# EAGLE design Doorbell (EAGLE 6.3)
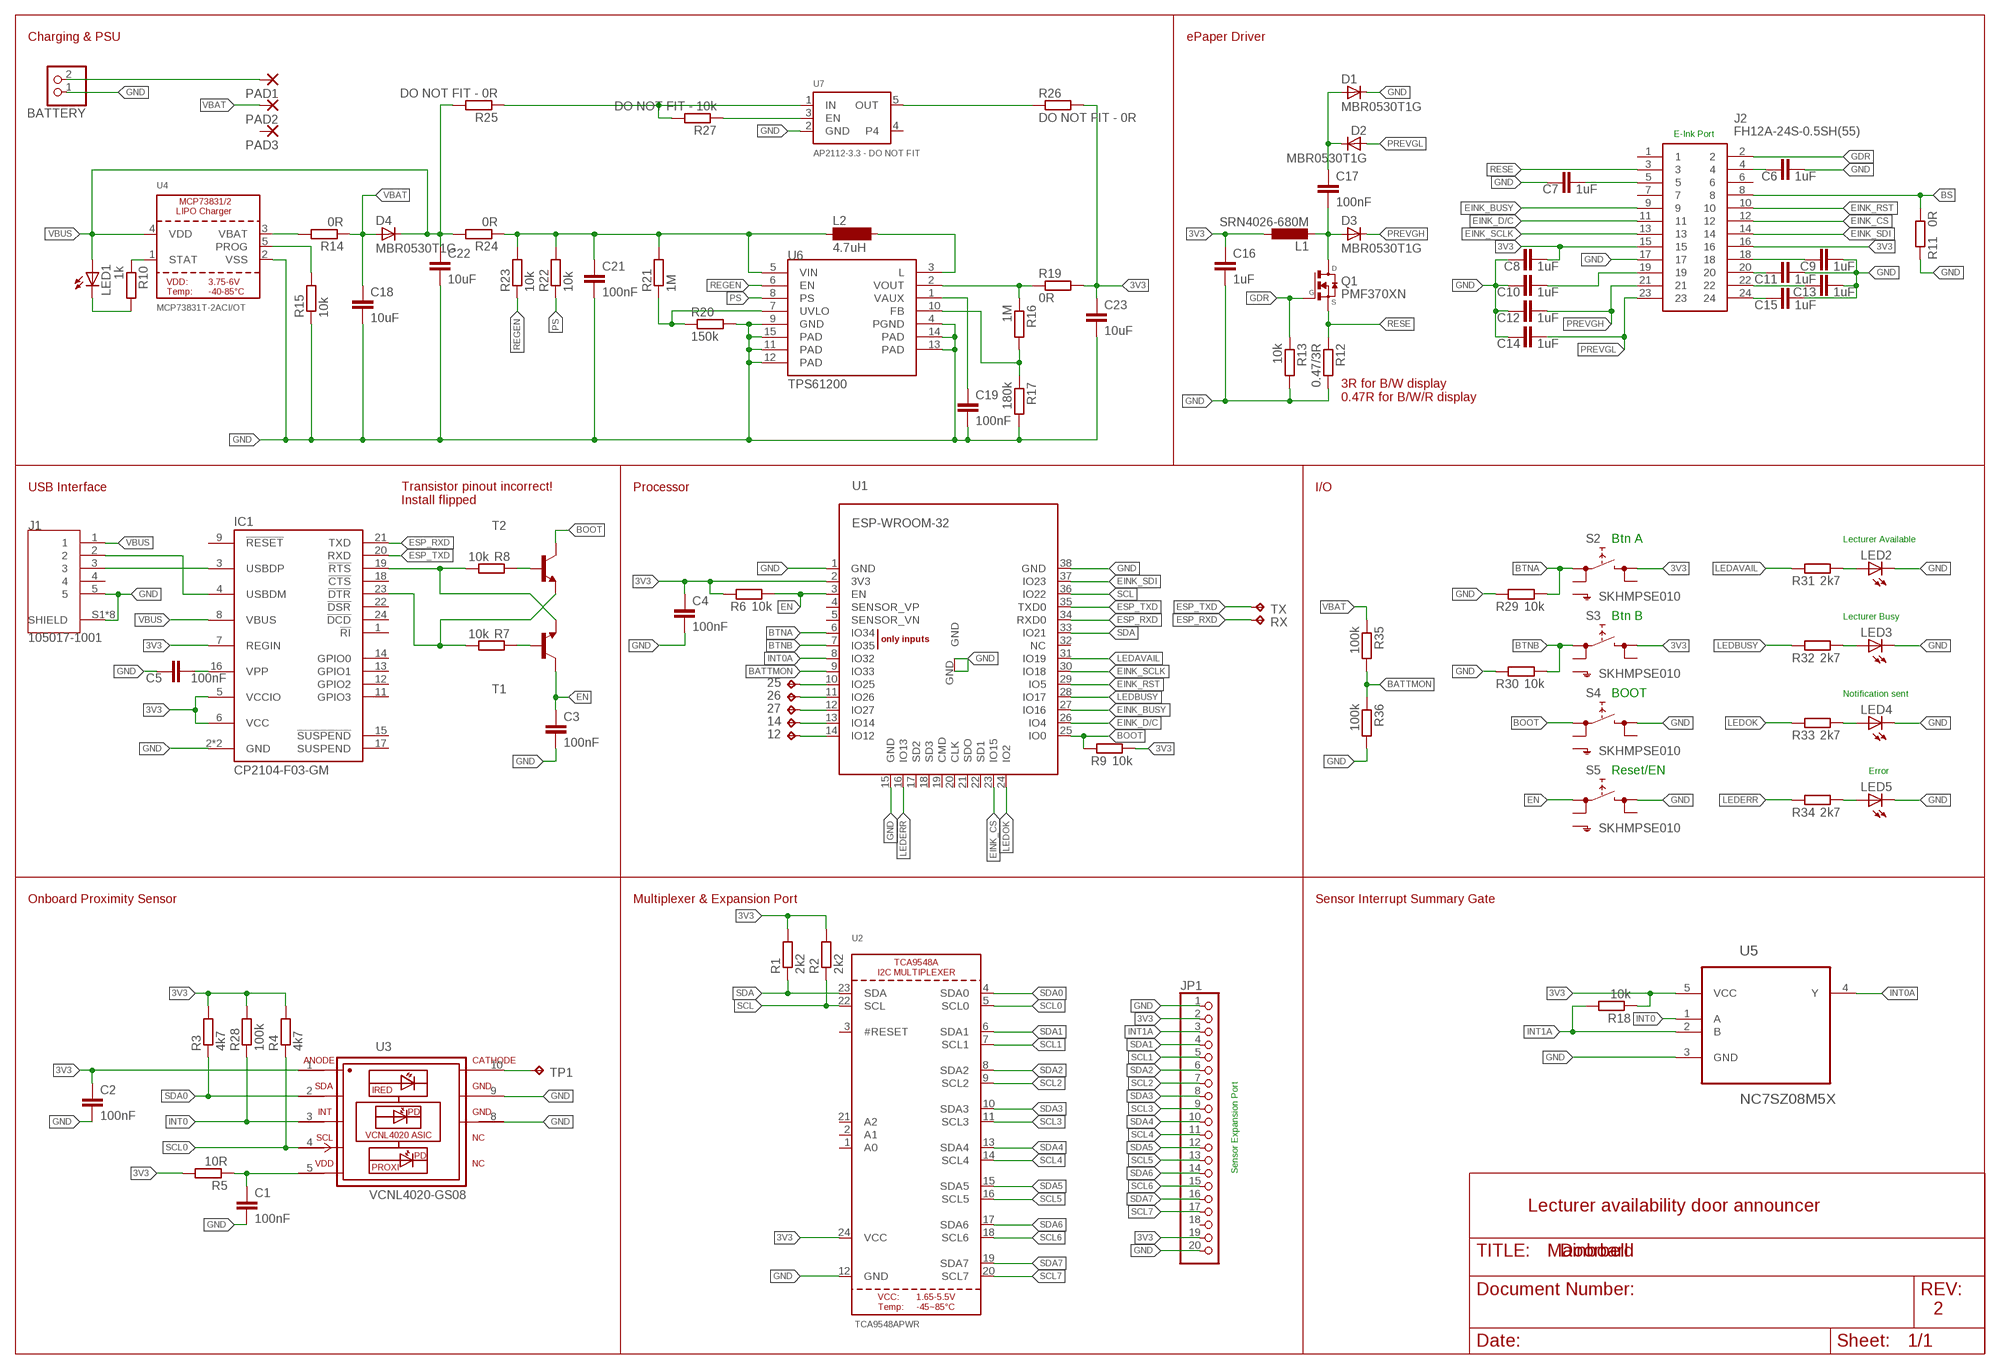
[diagram p0: schematic, sheet 1]

## Parts
12  TPB1,27  [B1,27]
14  TPB1,27  [B1,27]
25  TPB1,27  [B1,27]
26  TPB1,27  [B1,27]
27  TPB1,27  [B1,27]
BATTERY  PINHD-1X2/90  [1X02/90]
C1  100nF  C-EUC0603  [C0603]
C2  100nF  C-EUC0603  [C0603]
C3  100nF  C-EUC0603  [C0603]
C4  100nF  C-EUC0603  [C0603]
C5  100nF  C-EUC0603  [C0603]
C6  1uF  C-EUC0603  [C0603]
C7  1uF  C-EUC0603  [C0603]
C8  1uF  C-EUC0603  [C0603]
C9  1uF  C-EUC0603  [C0603]
C10  1uF  C-EUC0603  [C0603]
C11  1uF  C-EUC0603  [C0603]
C12  1uF  C-EUC0603  [C0603]
C13  1uF  C-EUC0603  [C0603]
C14  1uF  C-EUC0603  [C0603]
C15  1uF  C-EUC0603  [C0603]
C16  1uF  C-EUC0603  [C0603]
C17  100nF  C-EUC0603  [C0603]
C18  10uF  C-EUC1206  [C1206]
C19  100nF  C-EUC0603  [C0603]
C21  100nF  C-EUC0603  [C0603]
C22  10uF  C-EUC1206  [C1206]
C23  10uF  C-EUC1206  [C1206]
D1  MBR0530T1G  D-SOD123  [SOD123]
D2  MBR0530T1G  D-SOD123  [SOD123]
D3  MBR0530T1G  D-SOD123  [SOD123]
D4  MBR0530T1G  D-SOD123  [SOD123]
IC1  CP2104-F03-GM  [QFN24-PAD]
J1  105017-1001  [MOLEX_105017-1001]
J2  FH12A-24S-0.5SH(55)  [FH12A-24S-0.5SH]
JP1  PINHD-1X20/90  [1X20/90]
L1  SRN4026-680M  L-EUL4532P  [L4532P]
L2  4.7uH  MS50  [MS50]
LED1  LEDSML0603  [SML0603]
LED2  LEDSML0603  [SML0603]
LED3  LEDSML0603  [SML0603]
LED4  LEDSML0603  [SML0603]
LED5  LEDSML0603  [SML0603]
PAD1  WIREPADSMD1,27-254  [SMD1,27-2,54]
PAD2  WIREPADSMD1,27-254  [SMD1,27-2,54]
PAD3  WIREPADSMD1,27-254  [SMD1,27-2,54]
Q1  PMF370XN  BSS138W  [SOT323-R]
R1  2k2  R-EU_R0603  [R0603]
R2  2k2  R-EU_R0603  [R0603]
R3  4k7  R-EU_R0603  [R0603]
R4  4k7  R-EU_R0603  [R0603]
R5  10R  R-EU_R0603  [R0603]
R6  10k  R-EU_R0603  [R0603]
R7  10k  R-EU_R0603  [R0603]
R8  10k  R-EU_R0603  [R0603]
R9  10k  R-EU_R0603  [R0603]
R10  1k  R-EU_R0603  [R0603]
R11  0R  R-EU_R0603  [R0603]
R12  0.47/3R  R-EU_R0603  [R0603]
R13  10k  R-EU_R0603  [R0603]
R14  0R  R-EU_R0603  [R0603]
R15  10k  R-EU_R0603  [R0603]
R16  1M  R-EU_R0603  [R0603]
R17  180k  R-EU_R0603  [R0603]
R18  10k  R-EU_R0603  [R0603]
R19  0R  R-EU_R0603  [R0603]
R20  150k  R-EU_R0603  [R0603]
R21  1M  R-EU_R0603  [R0603]
R22  10k  R-EU_R0603  [R0603]
R23  10k  R-EU_R0603  [R0603]
R24  0R  R-EU_R0603  [R0603]
R25  DO NOT FIT - 0R  R-EU_R0603  [R0603]
R26  DO NOT FIT - 0R  R-EU_R0603  [R0603]
R27  DO NOT FIT - 10k  R-EU_R0603  [R0603]
R28  100k  R-EU_R0603  [R0603]
R29  10k  R-EU_R0603  [R0603]
R30  10k  R-EU_R0603  [R0603]
R31  2k7  R-EU_R0603  [R0603]
R32  2k7  R-EU_R0603  [R0603]
R33  2k7  R-EU_R0603  [R0603]
R34  2k7  R-EU_R0603  [R0603]
R35  100k  R-EU_R0603  [R0603]
R36  100k  R-EU_R0603  [R0603]
RX  TPB1,27  [B1,27]
S2  SKHMPSE010  [SKHMPXE010]
S3  SKHMPSE010  [SKHMPXE010]
S4  SKHMPSE010  [SKHMPXE010]
S5  SKHMPSE010  [SKHMPXE010]
T1  -NPN-SOT23-EBC  [SOT23-EBC]
T2  -NPN-SOT23-EBC  [SOT23-EBC]
TP1  TPB1,27  [B1,27]
TX  TPB1,27  [B1,27]
U1  ESP-WROOM-32  [ESP-WROOM-32]
U2  TCA9548APWR  TCA9548A  [TSSOP24]
U3  VCNL4020-GS08  [PHODET_VCNL4020]
U4  MCP73831T-2ACI/OT  MCP73831/2  [SOT23-5]
U5  NC7SZ08M5X  [SOT95P280X145-5N]
U6  TPS61200  [QFN-10_PAD]
U7  AP2112-3.3 - DO NOT FIT  VREG_SOT23-5  [SOT23-5]

## Nets
3V3: C2.1 C4.1 C8.2 C16.1 C23.1 IC1.5(VCCIO) IC1.6(VCC) IC1.7(REGIN) J2.15 J2.16 JP1.2 JP1.19 L1.1 R1.2 R2.2 R3.2 R4.2 R5.2 R6.2 R9.1 R18.1 R19.2 R26.2 R28.2 S2.3(2.1) S3.3(2.1) U1.2(3V3) U2.24(VCC) U3.1(IR-ANODE) U5.5(VCC)
BATTMON: R35.2 R36.1 U1.9(IO33)
BOOT: R9.2 S4.1(1.1) T2.C U1.25(IO0)
BS: J2.8 R11.1
BTNA: R29.1 S2.1(1.1) U1.6(IO34)
BTNB: R30.1 S3.1(1.1) U1.7(IO35)
DTR: IC1.23(!DTR) R7.1 T2.E
EINK_BUSY: J2.9 U1.27(IO16)
EINK_CS: J2.12 U1.23(IO15)
EINK_D/C: J2.11 U1.26(IO4)
EINK_RST: J2.10 U1.29(IO5)
EINK_SCLK: J2.13 U1.30(IO18)
EINK_SDI: J2.14 U1.37(IO23)
EN: C3.1 R6.1 S5.1(1.1) T1.C U1.3(EN)
ESP_RXD: IC1.21(TXD) RX.TP U1.34(RXD0)
ESP_TXD: IC1.20(RXD) TX.TP U1.35(TXD0)
GDR: J2.2 Q1.1(G) R13.1
GND: BATTERY.1 C1.2 C2.2 C3.2 C4.2 C5.1 C6.2 C7.1 C8.1 C9.2 C10.1 C11.2 C12.1 C13.2 C14.1 C15.2 C16.2 C18.2 C19.2 C21.2 C22.2 C23.2 D1.1(C) IC1.2(GND) IC1.TP(GND) J1.5 J1.S1(SHIELD) J1.S1.1(SHIELD) J1.S2(SHIELD) J1.S2.1(SHIELD) J1.S3(SHIELD) J1.S4(SHIELD) J1.S5(SHIELD) J1.S6(SHIELD) J2.17 JP1.1 JP1.20 LED2.C LED3.C LED4.C LED5.C R11.2 R12.2 R13.2 R15.1 R17.2 R20.2 R29.2 R30.2 R36.2 S4.3(2.1) S5.3(2.1) U1.1(GND) U1.15(GND) U1.38(GND) U1.GND U2.12(GND) U3.8(GND2) U3.9(GND) U4.2(VSS) U5.3(GND) U6.4(PGND) U6.9(GND) U6.11(PAD) U6.12(PAD) U6.13(PAD) U6.14(PAD) U6.15(PAD) U7.2(GND)
INT0: R28.1 U3.3(INT) U5.1(A)
INT0A: U1.8(IO32) U5.4(Y)
INT1A: JP1.3 R18.2 U5.2(B)
LEDAVAIL: R31.2 U1.31(IO19)
LEDBUSY: R32.2 U1.28(IO17)
LEDERR: R34.2 U1.16(IO13)
LEDOK: R33.2 U1.24(IO2)
N$1: TP1.TP U3.10(IR-CATHODE)
N$2: C1.1 R5.1 U3.5(VDD)
N$3: R7.2 T1.B
N$4: R16.1 R19.1 U6.2(VOUT)
N$5: R8.2 T2.B
N$6: IC1.4(USBDM) J1.2
N$7: IC1.3(USBDP) J1.3
N$8: C5.2 IC1.16(VPP)
N$9: C17.1 D1.2(A) D2.1(C)
N$10: R10.1 U4.1(STAT)
N$11: C10.2 J2.19
N$12: C17.2 D3.2(A) L1.2 Q1.3(D)
N$13: LED1.C R10.2
N$14: C15.1 J2.24
N$15: C13.1 J2.22
N$16: C11.1 J2.20
N$17: C9.1 J2.18
N$18: C6.1 J2.4
N$19: C7.2 J2.5
N$20: R14.2 U4.3(VBAT)
N$21: R15.2 U4.5(PROG)
N$22: BATTERY.2 PAD1.1(P)
N$23: R16.2 R17.1 U6.10(FB)
N$24: C19.1 U6.1(VAUX)
N$25: 12.TP U1.14(IO12)
N$26: R20.1 R21.1 U6.7(UVLO)
N$27: L2.2 U6.3(L)
N$28: R25.1 R27.2 U7.1(IN)
N$29: 14.TP U1.13(IO14)
N$30: R27.1 U7.3(EN)
N$31: 25.TP U1.10(IO25)
N$32: 26.TP U1.11(IO26)
N$33: 27.TP U1.12(IO27)
N$34: LED5.A R34.1
N$35: LED4.A R33.1
N$36: LED3.A R32.1
N$37: LED2.A R31.1
OUT: R26.1 U7.5(OUT)
PREVGH: C12.2 D3.1(C) J2.21
PREVGL: C14.2 D2.2(A) J2.23
PS: R22.1 U6.8(PS)
REGEN: R23.1 U6.6(EN)
RESE: J2.3 Q1.2(S) R12.1
RTS: IC1.19(!RTS) R8.1 T1.E
SCL: R2.1 U1.36(IO22) U2.22(SCL)
SCL0: R4.1 U2.5(SCL0) U3.4(SCL)
SCL1: JP1.5 U2.7(SCL1)
SCL2: JP1.7 U2.9(SCL2)
SCL3: JP1.9 U2.11(SCL3)
SCL4: JP1.11 U2.14(SCL4)
SCL5: JP1.13 U2.16(SCL5)
SCL6: JP1.15 U2.18(SCL6)
SCL7: JP1.17 U2.20(SCL7)
SDA: R1.1 U1.33(IO21) U2.23(SDA)
SDA0: R3.1 U2.4(SDA0) U3.2(SDA)
SDA1: JP1.4 U2.6(SDA1)
SDA2: JP1.6 U2.8(SDA2)
SDA3: JP1.8 U2.10(SDA3)
SDA4: JP1.10 U2.13(SDA4)
SDA5: JP1.12 U2.15(SDA5)
SDA6: JP1.14 U2.17(SDA6)
SDA7: JP1.16 U2.19(SDA7)
VBAT: C18.1 D4.2(A) PAD2.1(P) R14.1 R35.1
VBUS: C22.1 D4.1(C) IC1.8(VBUS) J1.1 LED1.A R24.2 R25.2 U4.4(VDD)
VIN: C21.1 L2.1 R21.2 R22.2 R23.2 R24.1 U6.5(VIN)
Unconnected: IC1.1(!RI) IC1.9(!RESET) IC1.11(GPIO3) IC1.12(GPIO2) IC1.13(GPIO1) IC1.14(GPIO0) IC1.15(!SUSPEND) IC1.17(SUSPEND) IC1.18(!CTS) IC1.22(!DSR) IC1.24(!DCD) J1.4 J2.1 J2.6 J2.7 JP1.18 PAD3.1(P) S2.2(1.2) S2.4(2.2) S2.5(SH) S3.2(1.2) S3.4(2.2) S3.5(SH) S4.2(1.2) S4.4(2.2) S4.5(SH) S5.2(1.2) S5.4(2.2) S5.5(SH) U1.4(SENSOR_VP) U1.5(SENSOR_VN) U1.17(SD2) U1.18(SD3) U1.19(CMD) U1.20(CLK) U1.21(SDO) U1.22(SD1) U1.32(NC) U2.1(A0) U2.2(A1) U2.3(#RESET) U2.21(A2) U7.4

## Notes on the sheet
- Charging & PSU | ePaper Driver
- E-Ink Port
- 3R for B/W display
  0.47R for B/W/R display
- USB Interface | Processor | I/O
- Transistor pinout incorrect!
  Install flipped
- Btn A | Lecturer Available
- Btn B | Lecturer Busy
- BOOT | Notification sent
- Reset/EN | Error
- Onboard Proximity Sensor | Multiplexer & Expansion Port | Sensor Interrupt Summary Gate
- Sensor Expansion Port
- Lecturer availability door announcer
- Mainboard
- 2

## Library data of the parts
12 14 25-27 RX TP1 TX = testpad:TP: Test pad
BATTERY = pinhead:PINHD-1X2: PIN HEADER
C1-C19 C21-C23 = rcl:C-EU: CAPACITOR, European symbol
D1-D4 = semicon-smd-ipc:D-: DIODE unfilled
IC1 = CP2104:CP2104: Silabs CP2104 USB to UART Bridge; AVAILABILITY: Unavailable; DESCRIPTION: USB to UART Bridge; MF: Silicon Labs; MP: CP2104; PACKAGE: QFN-24 Silicon Labs; PRICE: None
J1 = MolexMicroUSB:105017-1001: Conn USB Type B RCP 5 POS 0.65mm Solder RA Thru-Hole 5 Terminal 1 Port T/R; AVAILABILITY: Unavailable; DESCRIPTION: Conn USB Type B RCP 5 POS 0.65mm Solder RA Thru-Hole 5 Terminal 1 Port T/R; MF: Molex; MP: 105017-1001; PACKAGE: None; PRICE: None
J2 = SamacSys_Parts:FH12A-24S-0.5SH(55): FFC,0.5mm Pitch,Top Contact,24way Hirose FH12 Series 0.5mm Pitch 24 Way Right Angle SMT Female FPC Connector, ZIF Top Contact Source: Datasheet <https://componentsearchengine.com/Datasheets/1/FH12A-24S-0.5SH(55).pdf>; DESCRIPTION: FFC,0.5mm Pitch,Top Contact,24way Hirose FH12 Series 0.5mm Pitch 24 Way Right Angle SMT Female FPC Connector, ZIF Top Contact; HEIGHT: mm; MANUFACTURER_NAME: Hirose; MANUFACTURER_PART_NUMBER: FH12A-24S-0.5SH(55); MOUSER_PART_NUMBER: 798-FH12A-24S0.5SH55
JP1 = pinhead:PINHD-1X20: PIN HEADER
L1 = resistor:L-EU: INDUCTOR, European symbol
L2 = inductor-neosid:MS50: INDUCTOR SMD power inductor; OC_FARNELL: unknown; OC_NEWARK: unknown
LED1-LED5 = led:LED: LED OSRAM: - CHIPLED LG R971, LG N971, LY N971, LG Q971, LY Q971, LO R971, LY R971 LH N974, LH R974 LS Q976, LO Q976, LY Q976 LO Q996 - Hyper CHIPLED LW Q18S LB Q993, LB Q99A, LB R99A - SideLED LS A670, LO A670, LY A670, LG A670, LP A670 LB A673, LV A673, LT A673, LW A673 LH A674 LY A675 LS A676, LA A676, LO A676, LY A676, LW A676 LS A679, LY A679, LG A679 - Hyper Micro SIDELED® LS Y876, LA Y876, LO Y876, LY Y876 LT Y87S - SmartLED LW L88C, LW L88S LB L89C, LB L89S, LG L890 LS L89K, LO L89K, LY L89K LS L896, LA L896, LO L896, LY L896 - TOPLED LS T670, LO T670, LY T670, LG T670, LP T670 LSG T670, LSP T670, LSY T670, LOP T670, LYG T670 LG T671, LOG T671, LSG T671 LB T673, LV T673, LT T673, LW T673 LH T674 LS T676, LA T676, LO T676, LY T676, LB T676, LH T676, LSB T676, LW T676 LB T67C, LV T67C, LT T67C, LS T67K, LO T67K, LY T67K, LW E67C LS E67B, LA E67B, LO E67B, LY E67B, LB E67C, LV E67C, LT E67C LW T67C LS T679, LY T679, LG T679 LS T770, LO T770, LY T770, LG T770, LP T770 LB T773, LV T773, LT T773, LW T773 LH T774 LS E675, LA E675, LY E675, LS T675 LS T776, LA T776, LO T776, LY T776, LB T776 LHGB T686 LT T68C, LB T68C - Hyper Mini TOPLED® LB M676 - Mini TOPLED Santana® LG M470 LS M47K, LO M47K, LY M47K Source: http://www.osram.convergy.de LUXEON: - LUMILED® LXK2-PW12-R00, LXK2-PW12-S00, LXK2-PW14-U00, LXK2-PW14-V00 LXK2-PM12-R00, LXK2-PM12-S00, LXK2-PM14-U00 LXK2-PE12-Q00, LXK2-PE12-R00, LXK2-PE12-S00, LXK2-PE14-T00, LXK2-PE14-U00 LXK2-PB12-K00, LXK2-PB12-L00, LXK2-PB12-M00, LXK2-PB14-N00, LXK2-PB14-P00, LXK2-PB14-Q00 LXK2-PR12-L00, LXK2-PR12-M00, LXK2-PR14-Q00, LXK2-PR14-R00 LXK2-PD12-Q00, LXK2-PD12-R00, LXK2-PD12-S00 LXK2-PH12-R00, LXK2-PH12-S00 LXK2-PL12-P00, LXK2-PL12-Q00, LXK2-PL12-R00 Source: www.luxeon.com KINGBRIGHT: KA-3528ASYC Source: www.kingbright.com
PAD1-PAD3 = wirepad:WIREPAD: Wire PAD connect wire on PCB
Q1 = BSS138W:BSS138W: N-Channel MOSFET; AVAILABILITY: Unavailable; DESCRIPTION: N-Channel 50 V 3.5 Ohm SMT Enhancement Mode Field Effect Transistor - SOT-323; MF: ON Semiconductor; MP: BSS138W; PACKAGE: SOT-323 ON Semiconductor; PRICE: None
R1-R36 = rcl:R-EU_: RESISTOR, European symbol
S2-S5 = switch:SKHMP*E010: 6.2 X 6.5mm TACT Switch (SMD) Source: http://www3.alps.co.jp/WebObjects/catalog.woa/PDF/E/Switch/Tact/SKHM/SKHM.PDF
T1 T2 = transistor:*-NPN-: NPN Transistror BF959 corrected 2008.03.06
U1 = esp32:ESP-WROOM-32
U2 = microbuilder:TCA9548A: TCA9548A I2C Multiplexer
U3 = VCNL4020-GS08:VCNL4020-GS08: VCNL4020 Fully Integrated Proximity and Ambient Light Sensor with Infrared Emitter, I2C Interface, and Interrupt Function: The VCNL4020 is a fully integrated proximity and ambient light sensor. Fully integrated means that the infrared emitter is included in the package. It has 16 bit resolution. It includes a signal processing IC and features standard I2C communication interface. It features an interrupt function. Device Model created 15.06.2016 by Johannes Kolb - Vishay Semiconductor GmbH; AVAILABILITY: Unavailable; DESCRIPTION: VCNL4020 Series 2.5 - 3.6 V 200 mm Range SMT Proximity and Ambient Light Sensor; MF: Vishay Semiconductor; MP: VCNL4020-GS08; PACKAGE: VDFN-10 Vishay; PRICE: None
U4 = microbuilder:MCP73831/2: MCP73831/2 LIPO Charger VDD: 3.75 - 6V Temp -40 - 85°C Programmable Charge Rate: 15-500mA NOTE: STAT is a tri-state logic output on the MCP73831 and an open-drain output on the MCP73832. SOT23-5 with 4.2V output and tri-state logic on STAT = MCP73831T-2ACI/OT
U5 = NC7SZ08M5X:NC7SZ08M5X: Tiny logic UHS Two Input AND Gate; DIGI-KEY_PART_NUMBER: NC7SZ08M5XCT-ND; DIGI-KEY_PURCHASE_URL: https://www.digikey.com/product-detail/en/on-semiconductor/NC7SZ08M5X/NC7SZ08M5XCT-ND/673390?utm_source=snapeda&utm_medium=aggregator&utm_campaign=symbol; MF: ON Semiconductor; MP: NC7SZ08M5X; PACKAGE: SOT-23 Texas Instruments
U6 = SparkFun:TPS61200: DC to DC Booster
U7 = microbuilder:VREG_SOT23-5: SOT23-5 Fixed Voltage Regulators Part Current Out V Out V In V Dropout θJA (°C/W) TJ (°C) Digikey Part No. ADP121 150mA 3.3V 3.4-5.5V 0.09V @ 150mA -- -- ADP121-AUJZ33R7CT-ND ADP121 150mA 3.0V 3.1-5.5V 0.09V @ 150mA -- -- ADP121-AUJZ30R7CT-ND ADP122 300mA 3.3V 3.4-5.5V 0.085V @ 300mA -- -- ADP122AUJZ-3.3-R7CT-ND ADP1712 300mA 3.3V 3.5-5.5V 0.17V @ 300mA -- -- ADP1712AUJZ-3.3-R7TR-ND AP7311 (Low Cost) 150mA 3.3V 3.5-6V 0.15V @ 150mA -- -- AP7311-33WG-7DICT-ND LD39015M18R 150mA 1.8V 1.9V-5.5V 0.08V @ 100mA -- -- 497-6977-1-ND LP2985A-33DBVR 150mA 3.3V 3.3-16V 0.28V @ 150mA 206 150 296-18479-1-ND MCP1824T-3302E/OT 300mA 3.3V 3.5V-6V 0.2V @ 300mA -- -- MCP1824T-3302E/OTCT-ND MIC5205-2.5YM5 TR 150mA 2.5V 2.7-16V 0.165V @ 150mA -- -- 576-1257-2-ND MIC5205-3.0YM5 TR 150mA 3.0V 3.2V-16V 0.165V @ 150mA -- -- 576-1258-2-ND MIC5205-3.3YM5 TR 150mA 3.3V 3.5V-16V 0.165V @ 150mA -- -- 576-1259-2-ND TPS780330220 150mA 3.3V+2.2V 3.6-5.5V 250mV Max -- -- 296-23332-1-ND TDA3663/N1,135 100mA 3.3V 3.5-45V 0.18V @ 50mA -- -- 568-5343-1-ND Max operating temp can be calculated using θJA, TJ (max junction temperature), and power in watts. Set the "Maximum Ambient Temperature" until it reaches TJ ("Max Junction Temperature"), which is the absolute limit for safe use of the regulator: Heat Sink Temperature Calculator <http://www.daycounter.com/Calculators/Heat-Sink-Temperature-Calculator.phtml> For example, With 12V source into a 3.3V LP2985 and a 30mA load, we are dissipating (12V-3.3V) * 0.03A = 0.261W. With a θJA of 206 °C/W, a TJ of 150°C, and 261mW we can safely use the chip without a heat sink up to 75°C (=147.1°C Junction Temperature).

## Board
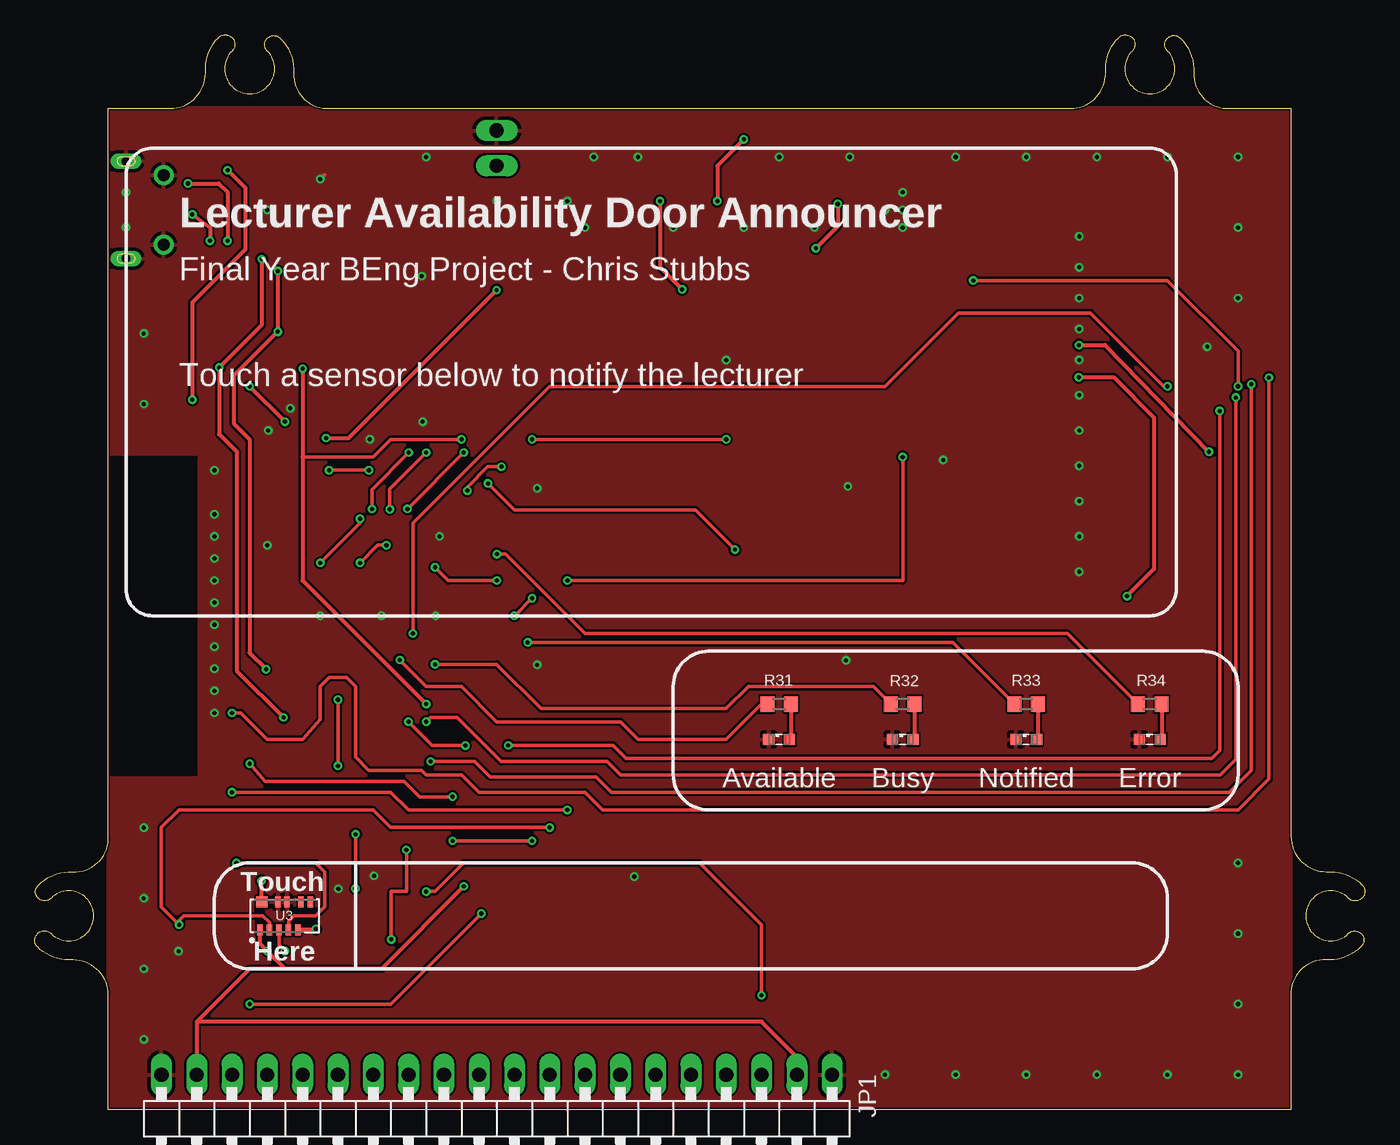
[diagram p1: board, top side]
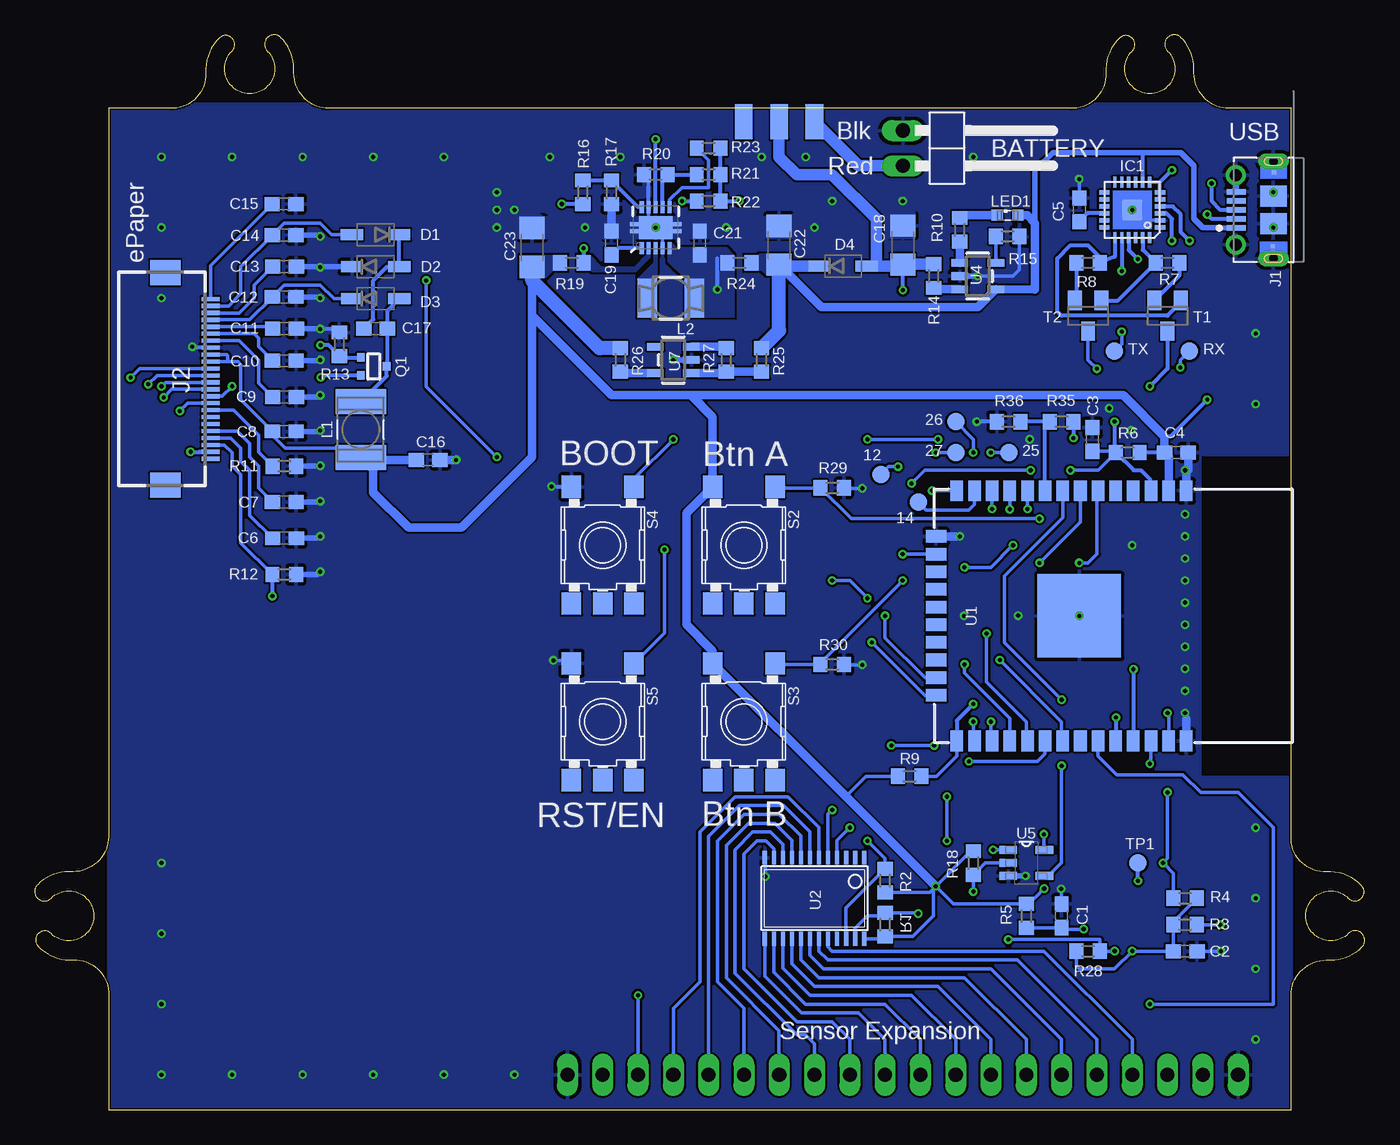
[diagram p2: board, bottom side, seen from below]

Size 95.7 x 77.38 mm. Coordinates in mm from the lower left corner, seen from the top.
Outline: 5.3,8.26 arc90 2.76,10.79 2.45,10.79 arc-45 0.2,11.72 arc-180 1.18,12.7 arc135 4.24,13.98 arc135 1.18,15.24 arc-180 0.24,16.17 arc-47 2.76,17.14 arc95 5.3,19.68 5.3,72.07 9.75,72.07 arc90 12.29,74.61 12.29,74.93 arc-45 13.22,77.17 arc-180 14.19,76.2 arc135 15.47,73.13 arc135 16.73,76.2 arc-180 17.66,77.13 arc-47 18.64,74.61 arc95 21.18,72.07 74.52,72.07 arc90 77.06,74.61 77.06,74.93 arc-45 77.99,77.17 arc-180 78.96,76.2 arc135 80.24,73.13 arc135 81.5,76.2 arc-181 82.43,77.13 arc-47 83.41,74.61 arc95 85.95,72.07 90.39,72.07 90.39,19.68 arc90 92.93,17.14 93.25,17.14 arc-45 95.5,16.21 arc-180 94.52,15.24 arc135 91.46,13.97 arc135 94.52,12.7 arc-180 95.45,11.77 arc-48 92.93,10.79 arc96 90.39,8.26 90.39,0 5.3,0 5.3,8.26
Copper layers (1*16): Top 0.035mm / dielectric 1.5mm / Bottom 0.035mm
Design rules "hackvana": minimum track width 6mil, minimum drill 0.3mm, track to track 6mil, track to pad 6mil, pad to pad 6mil, via to via 6mil, smd to smd 0mil, copper to edge 6mil, drill to drill 6mil, minimum pad ring 10mil, minimum via ring 6mil, stop-mask expansion 2mil, vias tented up to drill 100mil, thermal gap 10mil

### Footprints (pad centres in the part's own frame; a part is rotated, then mirrored left to right if it is on the bottom)
B1,27 = smd 1.27 x 1.27: TP 0,0
1X02/90 = drill 1.016 long: 1 -1.27,-3.81; 2 1.27,-3.81
C0603 = smd 1.1 x 1: 1 -0.85,0; 2 0.85,0
C1206 = smd 1.6 x 1.8: 1 -1.4,0; 2 1.4,0
SOD123 = smd 1.6 x 0.8: 1 -1.7,0; 2 1.7,0
QFN24-PAD = smd 0.8 x 0.3: 1 -2,1.25; 2 -2,0.75; 3 -2,0.25; 4 -2,-0.25; 5 -2,-0.75; 6 -2,-1.25; 13 2,-1.25; 14 2,-0.75; 15 2,-0.25; 16 2,0.25; 17 2,0.75; 18 2,1.25 | smd 0.3 x 0.8: 7 -1.25,-2; 8 -0.75,-2; 9 -0.25,-2; 10 0.25,-2; 11 0.75,-2; 12 1.25,-2; 19 1.25,2; 20 0.75,2; 21 0.25,2; 22 -0.25,2; 23 -0.75,2; 24 -1.25,2 | smd 1.5 x 1.5: TP 0,0
MOLEX_105017-1001 = smd 0.4 x 1.35: 1 -1.3,2.675; 2 -0.65,2.675; 3 0,2.675; 4 0.65,2.675; 5 1.3,2.675 | drill 0.6 pad 0.95 long: S1 -3.5,0; S2 3.5,0 | smd 0.3 x 0.3: S1.1 -2.6,0.05; S2.1 2.7,-0.05 | drill 0.85 pad 1.45: S3 -2.5,2.7; S4 2.5,2.7 | smd 1.5 x 1.9: S5 -1,0; S6 1,0
FH12A-24S-0.5SH = smd 0.3 x 1.3: 1 -5.75,-0.4; 2 -5.25,-0.4; 3 -4.75,-0.4; 4 -4.25,-0.4; 5 -3.75,-0.4; 6 -3.25,-0.4; 7 -2.75,-0.4; 8 -2.25,-0.4; 9 -1.75,-0.4; 10 -1.25,-0.4; 11 -0.75,-0.4; 12 -0.25,-0.4; 13 0.25,-0.4; 14 0.75,-0.4; 15 1.25,-0.4; 16 1.75,-0.4; 17 2.25,-0.4; 18 2.75,-0.4; 19 3.25,-0.4; 20 3.75,-0.4; 21 4.25,-0.4; 22 4.75,-0.4; 23 5.25,-0.4; 24 5.75,-0.4 | smd 1.8 x 2.2: 25 -7.65,2.85; 26 7.65,2.85
1X20/90 = drill 1.016 long: 1 -24.13,-3.81; 2 -21.59,-3.81; 3 -19.05,-3.81; 4 -16.51,-3.81; 5 -13.97,-3.81; 6 -11.43,-3.81; 7 -8.89,-3.81; 8 -6.35,-3.81; 9 -3.81,-3.81; 10 -1.27,-3.81; 11 1.27,-3.81; 12 3.81,-3.81; 13 6.35,-3.81; 14 8.89,-3.81; 15 11.43,-3.81; 16 13.97,-3.81; 17 16.51,-3.81; 18 19.05,-3.81; 19 21.59,-3.81; 20 24.13,-3.81
L4532P = smd 1.8 x 3.6: 1 -2,0; 2 2,0
MS50 = smd 2.8 x 1.4: 1 0,-1.7; 2 0,1.7
SML0603 = smd 0.8 x 0.8: A 0.75,0; C -0.75,0
SMD1,27-2,54 = smd 1.27 x 2.54: 1 0,0
SOT323-R = smd 0.6 x 0.55: 1 -0.65,-0.925; 2 0.65,-0.925; 3 0,0.925
R0603 = smd 1 x 1.1: 1 -0.85,0; 2 0.85,0
SKHMPXE010 = smd 1.6 x 1.4: 1 -4.2,2.25; 2 4.2,2.25; 3 -4.2,-2.25; 4 4.2,-2.25; 5 4.2,0
SOT23-EBC = smd 1 x 1.4: B 0.95,-1.1; C 0,1.1; E -0.95,-1.1
ESP-WROOM-32 = smd 0.9 x 1.5: 1 7.7,9; 2 6.43,9; 3 5.16,9; 4 3.89,9; 5 2.62,9; 6 1.35,9; 7 0.08,9; 8 -1.19,9; 9 -2.46,9; 10 -3.73,9; 11 -5,9; 12 -6.27,9; 13 -7.54,9; 14 -8.81,9; 25 -8.81,-9; 26 -7.54,-9; 27 -6.27,-9; 28 -5,-9; 29 -3.73,-9; 30 -2.46,-9; 31 -1.19,-9; 32 0.08,-9; 33 1.35,-9; 34 2.62,-9; 35 3.89,-9; 36 5.16,-9; 37 6.43,-9; 38 7.7,-9 | smd 1.5 x 0.9: 15 -10.3,5.715; 16 -10.3,4.445; 17 -10.3,3.175; 18 -10.3,1.905; 19 -10.3,0.635; 20 -10.3,-0.635; 21 -10.3,-1.905; 22 -10.3,-3.175; 23 -10.3,-4.445; 24 -10.3,-5.715 | smd 6 x 6: GND 0,0
TSSOP24 = smd 0.305 x 0.991: 1 -3.575,-2.918; 2 -2.925,-2.918; 3 -2.275,-2.918; 4 -1.625,-2.918; 5 -0.975,-2.918; 6 -0.325,-2.918; 7 0.325,-2.918; 8 0.975,-2.918; 9 1.625,-2.918; 10 2.275,-2.918; 11 2.925,-2.918; 12 3.575,-2.918; 13 3.575,2.918; 14 2.925,2.918; 15 2.275,2.918; 16 1.625,2.918; 17 0.975,2.918; 18 0.325,2.918; 19 -0.325,2.918; 20 -0.975,2.918; 21 -1.625,2.918; 22 -2.275,2.918; 23 -2.925,2.918; 24 -3.575,2.918
PHODET_VCNL4020 = smd 0.8 x 0.4: 1 -1,1.8; 2 -1,1.115; 3 -1,0.43; 4 -1,-0.255; 5 -1,-0.94; 6 1,-1.83; 7 1,-1.15; 8 1,-0.15; 9 1,0.5 | smd 0.8 x 0.83: 10 1,1.665
SOT23-5 = smd 0.55 x 1.2: 1 -0.95,-1.3; 2 0,-1.3; 3 0.95,-1.3; 4 0.95,1.3; 5 -0.95,1.3
SOT95P280X145-5N = smd 1.27 x 0.559: 1 -1.295,0.94; 2 -1.295,0; 3 -1.295,-0.94; 4 1.295,-0.94; 5 1.295,0.94
QFN-10_PAD = smd 0.297 x 0.85: 1 -1,-1.475; 2 -0.5,-1.475; 3 0,-1.475; 4 0.5,-1.475; 5 1,-1.475; 6 1,1.475; 7 0.5,1.475; 8 0,1.475; 9 -0.5,1.475; 10 -1,1.475 | smd 0.7 x 0.28: 11 -1.5,0.25; 12 -1.5,-0.25; 13 1.5,0.25; 14 1.5,-0.25 | smd 2.4 x 1.65: 15 0,0

### Placement (x,y rotation side)
12  34.83,45.73 90 bottom
14  32.13,43.73 0 bottom
25  25.62,47.31 0 bottom
26  29.43,49.53 0 bottom
27  29.43,47.31 0 bottom
BATTERY  29.43,69.22 270 bottom
C1  21.81,13.97 90 bottom
C2  12.92,11.43 0 bottom
C3  19.59,48.26 90 bottom
C4  13.56,47.31 0 bottom
C5  20.54,64.77 270 bottom
C6  77.73,41.14 0 bottom
C7  77.74,43.76 180 bottom
C8  77.74,48.84 180 bottom
C9  77.73,51.3 0 bottom
C10  77.74,53.92 180 bottom
C11  77.73,56.23 0 bottom
C12  77.75,58.51 180 bottom
C13  77.73,60.68 0 bottom
C14  77.75,62.96 180 bottom
C15  77.77,65.19 0 bottom
C16  67.39,46.78 0 bottom
C17  71.18,56.22 0 bottom
C18  33.24,62.23 90 bottom
C19  54.2,62.39 90 bottom
C21  47.85,62.39 90 bottom
C22  42.14,62.22 90 bottom
C23  59.91,62.07 90 bottom
D1  71.17,60.68 0 bottom
D2  71.17,62.99 180 bottom
D3  71.17,58.39 0 bottom
D4  37.53,60.73 0 bottom
IC1  16.73,64.77 180 bottom
J1  6.57,64.77 90 bottom
J2  83.45,52.61 90 bottom
JP1  33.24,-1.27 180 top
L1  72.23,48.96 90 bottom
L2  49.93,58.42 90 bottom
LED1  25.7,64.38 0 bottom
LED2  53.56,26.67 0 top
LED3  62.45,26.67 0 top
LED4  71.34,26.67 0 top
LED5  80.23,26.67 0 top
PAD1  39.59,71.12 0 bottom
PAD2  42.13,71.12 0 bottom
PAD3  44.67,71.12 0 bottom
Q1  71.31,53.51 270 bottom
R1  34.51,13.34 270 bottom
R2  34.51,16.51 270 bottom
R3  12.92,13.34 180 bottom
R4  12.92,15.24 0 bottom
R5  24.35,13.97 90 bottom
R6  17.05,47.31 0 bottom
R7  14.19,60.96 0 bottom
R8  19.91,60.96 180 bottom
R9  32.75,24.02 0 bottom
R10  29.15,63.35 90 bottom
R11  77.73,46.33 0 bottom
R12  77.75,38.54 0 bottom
R13  73.78,55.11 90 bottom
R14  31.02,60.01 270 bottom
R15  25.7,62.86 180 bottom
R16  56.26,66.04 90 bottom
R17  54.2,66.04 270 bottom
R18  28.16,17.78 270 bottom
R19  57.06,60.96 180 bottom
R20  51.02,67.31 180 bottom
R21  47.21,67.31 0 bottom
R22  47.21,65.41 0 bottom
R23  47.21,69.22 0 bottom
R24  44.99,60.96 0 bottom
R25  43.4,53.98 90 bottom
R26  53.56,53.98 90 bottom
R27  45.94,53.98 270 bottom
R28  19.91,11.43 180 bottom
R29  38.32,44.77 0 bottom
R30  38.32,32.07 0 bottom
R31  53.56,29.21 180 top
R32  62.45,29.21 180 top
R33  71.34,29.21 180 top
R34  80.23,29.21 180 top
R35  21.81,49.53 180 bottom
R36  25.62,49.53 180 bottom
RX  12.61,54.61 0 bottom
S2  44.67,40.64 270 bottom
S3  44.67,27.94 270 bottom
S4  54.83,40.64 270 bottom
S5  54.83,27.94 270 bottom
T1  14.19,57.15 180 bottom
T2  19.91,57.15 180 bottom
TP1  16.32,17.78 0 bottom
TX  18,54.61 0 bottom
U1  20.54,35.56 0 bottom
U2  39.59,15.24 180 bottom
U3  18,13.97 90 top
U4  27.85,60.01 270 bottom
U5  24.35,17.78 0 bottom
U6  51.02,63.5 0 bottom
U7  49.75,53.98 90 bottom

### Tracks (layer width: path | path; a pad name or v marks a point on that pad's centre or on a via)
3V3  (via drill 0.3)
  Top 0.254: v23.07,15.94 v23.09,19.84
  Top 0.305: v30.87,16.09 24.94,10.16 18,10.16 | 18,10.16 v16.73,11.43 16.2,11.96 U3.1 | 18,10.16 15.46,10.16 11.65,6.35 | 11.65,6.35 JP1.19 | JP1.2 54.83,3.81 52.29,6.35 11.65,6.35 | v13.88,67.63 15.15,66.36 15.15,61.91 11.34,58.1 v11.34,51.12
  Bottom 0.254: IC1.7 14.73,66.77 IC1.6 IC1.5 | J2.16 81.89,54.36 81.82,54.29 81.82,53.98 81.94,53.86 | 81.94,53.86 J2.15 | 81.94,53.86 81.07,53.86 80.87,53.66 80.87,51.11 C8.2 78.59,48.52 77.69,47.62 72.9,47.62 L1.1 | v30.87,16.09 29.6,14.82 R5.2 24.14,14.82 v23.07,15.94 | R4.2 13.77,13.54 R3.2 C2.1 v16.73,11.43 18,10.16 20.54,10.16 20.76,10.38 R28.2 | v23.09,19.84 23.09,18.75 U5.5 | R18.1 28.34,18.63 v30.87,16.09 | R9.1 35.9,24.02 37.35,22.57 | U2.24 34.68,12.32 R1.2 32.51,12.48 31.02,13.97 31.02,15.94 v30.87,16.09 | R2.2 31.31,15.66 v30.87,16.09
  Bottom 0.305: C4.1 R6.2 | IC1.5 14.73,66.77 v13.88,67.63 | v11.34,51.12 13.98,48.48 14.41,48.48
  Bottom 0.61: U1.2 14.11,47.01 C4.1 14.41,48.48 17.37,51.44 48.48,51.44 | 48.48,51.44 54.2,51.44 59.91,57.15 | 59.91,57.15 C23.1 | 48.48,51.44 46.92,49.88 S2.3 48.8,42.96 48.8,34.92 46.92,33.05 S3.3 37.35,22.57 v30.87,16.09 | 59.91,57.15 59.91,46.99 64.99,41.91 68.8,41.91 71.34,44.45 71.34,46.07 71.8,46.53 | 71.8,46.53 L1.1 | C16.1 71.55,46.78 71.8,46.53
  Bottom 1.016: R26.2 55.05,54.83 59.91,59.69 C23.1
  pour Bottom (no thermals): 60.81,59.88 58.94,59.88 58.4,60.41 57.42,60.41 57.41,60.43 57.41,61.5 57.42,61.51 60.75,61.51 60.8,61.46 60.8,59.99 60.77,59.96
BATTMON
  Bottom 0.305: R36.1 R35.2 23,49.19 U1.9
BOOT  (via drill 0.3)
  Top 0.254: 19.27,46.99 24.35,46.99 25.62,48.26 v30.7,48.26 | v49.75,48.26 v35.78,48.26
  Top 0.305: v19.27,53.34 19.27,46.99 19.27,38.1 v28.16,29.21
  Bottom 0.254: R9.2 30.81,24.02 29.35,25.47 U1.25 | S4.1 52.58,45.43 v49.75,48.26 | v35.78,48.26 v30.7,48.26 | v19.27,53.34 19.91,53.98 T2.C
  Bottom 0.305: v28.16,29.21 29.35,28.02 U1.25
BS
  Bottom 0.254: J2.8 81.38,50.36 79.6,48.58 79.6,47.35 R11.1
BTNA  (via drill 0.3)
  Top 0.254: v23.4,42.55 23.4,42.23 v20.54,39.37
  Bottom 0.254: S2.1 42.35,44.77 R29.1 36.95,42.55 v23.4,42.55 | v20.54,39.37 19.91,39.37 19.27,40.01 19.27,44.48 U1.6
BTNB  (via drill 0.3)
  Top 0.254: v33.24,38.1 29.75,38.1 v28.8,39.05 | v25.31,40.64 24.67,40.64 v23.4,39.37
  Bottom 0.254: S3.1 42.35,32.07 R30.1 39.17,32.17 v33.24,38.1 | v28.8,39.05 26.89,39.05 v25.31,40.64 | v23.4,39.37 20.46,42.31 U1.7
DTR
  Bottom 0.305: IC1.23 15.98,61.9 R7.1 17.75,58.25 T2.E
EINK_BUSY  (via drill 0.3)
  Top 0.254: v85.26,50.3 85.26,25.87 84.69,25.29 42.56,25.29 41.62,26.23 v34.07,26.23 | v30.99,26.23 28.6,26.23 v26.89,27.94
  Bottom 0.254: J2.9 84.7,50.86 v85.26,50.3 | v34.07,26.23 v30.99,26.23 | v26.89,27.94 26.89,26.64 U1.27
EINK_CS  (via drill 0.3)
  Top 0.254: v86.58,52.07 86.58,54.61 81.5,59.69 v67.53,59.69 | v62.45,46.99 62.45,38.1 v38.32,38.1 | v35.78,36.83 v34.51,35.56
  Bottom 0.254: J2.12 86.29,52.36 v86.58,52.07 | v67.53,59.69 67.53,52.07 v62.45,46.99 | v38.32,38.1 37.05,38.1 v35.78,36.83 | v34.51,35.56 34.51,33.97 31.66,31.11 U1.23
EINK_D/C  (via drill 0.3)
  Top 0.254: v86.42,51.28 86.42,25.24 85.31,24.13 42.13,24.13 41.18,25.08 33.56,25.08 30.39,28.26 28.48,28.26 v28.16,27.94
  Bottom 0.254: J2.11 85.84,51.86 v86.42,51.28 | v28.16,27.94 28.16,26.64 U1.26
EINK_RST  (via drill 0.3)
  Top 0.254: v81.5,52.07 81.25,52.07 75.97,57.35 66.46,57.35 61.18,52.07 37.05,52.07 27.21,42.23 v27.21,34.29
  Bottom 0.254: J2.10 82.21,51.36 v81.5,52.07 | v27.21,34.29 27.21,30.8 24.35,27.94 24.35,26.64 U1.29
EINK_SCLK  (via drill 0.3)
  Top 0.254: v87.54,52.23 87.54,24.45 85.95,22.86 41.5,22.86 40.39,23.97 32.77,23.97 31.66,25.08 v28.48,25.08
  Bottom 0.254: J2.13 86.9,52.86 v87.54,52.23 | v28.48,25.08 23.56,25.08 23,25.64 U1.30
EINK_SDI  (via drill 0.3)
  Top 0.254: v88.81,52.7 88.81,23.81 86.58,21.59 40.86,21.59 39.59,22.86 31.97,22.86 30.7,24.13 28.16,24.13 27.85,24.45 24.04,24.45 23.08,25.4 23.08,30.48 22.45,31.11 21.18,31.11 20.54,30.48 20.54,28.1 19.27,26.67 16.73,26.67 14.83,28.57 v14.19,28.57
  Bottom 0.254: J2.14 88.15,53.36 v88.81,52.7 | v14.19,28.57 14.11,28.5 U1.37
EN  (via drill 0.3)
  Top 0.254: v50.39,40.32 47.53,43.18 34.51,43.18 v32.61,45.09 | v24.04,46.04 v21.18,46.04
  Top 0.305: v15.46,52.07 v18,49.53
  Bottom 0.254: S5.1 50.39,34.34 v50.39,40.32 | v32.61,45.09 31.66,46.04 v24.04,46.04 | v21.18,46.04 19.17,46.04 18.27,46.94 | 18.27,46.94 R6.1 | C3.1 18.27,47.41 18.27,46.94
  Bottom 0.305: U1.3 15.46,44.64 15.46,45.4 16.1,46.04 16.63,46.04 R6.1 18,47.41 v18,49.53 | T1.C 14.19,53.34 v15.46,52.07
ESP_RXD  (via drill 0.3)
  Top 0.305: v16.33,61.23 16.33,56.49 v13.27,53.43 13.27,48.64 14.54,47.37 14.54,31.61 v17.91,28.25
  Bottom 0.254: v13.27,53.43 13.27,53.95 RX.TP
  Bottom 0.305: IC1.21 16.98,61.88 v16.33,61.23 | v17.91,28.25 17.91,26.58 U1.34
ESP_TXD  (via drill 0.3)
  Top 0.305: v17.49,60.37 v17.49,56.01 14.33,52.85 14.33,49.4 15.46,48.26 15.46,32.91 v16.64,31.73
  Bottom 0.254: v17.49,56.01 17.49,55.13 TX.TP
  Bottom 0.305: IC1.20 v17.48,60.38 v17.49,60.37 | v16.64,31.73 U1.35
GDR  (via drill 0.3)
  Top 0.305: v75.13,55.04 77,55.04 v84.49,47.36
  Bottom 0.305: Q1.1 73.68,54.16 R13.1 74.57,55.04 v75.13,55.04 | v84.49,47.36 83.52,47.35 83.85,47.37 J2.2
GND  (via drill 0.3)
  Top 0.254: v20.54,66.99 20.86,67.31
  Bottom 0.254: U6.4 50.51,63.28 51.52,63.28 U6.9 | C5.1 v20.54,66.99 | IC1.2 15.98,64.02 IC1.TP | R15.1 24.85,60.47 25.31,60.01 v27.85,60.01 | C2.2 v10.35,11.42 | C1.2 21.81,16 v21.85,15.91 | S5.3 57.3,32.35 v58.38,32.35 | R29.2 37.44,44.74 v36.15,44.74 | R30.2 37.44,32.04 v36.15,32.04 | J1.S1.1 6.62,61.32 J1.S1 | J1.S2 6.57,67.52 J1.S2.1 | v6.57,66.04 J1.S6 | J1.S5 v6.57,63.5
  Bottom 0.305: U6.9 51.52,66.96 R20.2 | J2.17 84.29,54.86 v84.36,54.93 | R13.2 74.03,56.2 v75.15,56.2 | R36.2 v27.91,49.53 | U2.12 43.17,16.8 v43.14,16.8 | S4.3 58.48,44.84 v58.51,44.87
  Bottom 0.406: U4.2 v27.85,60.01 | U7.2 v49.75,53.98 | D1.1 75.11,60.68 v75.15,60.64 75.19,60.68 C13.2 | C10.1 75.21,53.91 v75.15,53.98 | C11.2 75.19,56.23 v75.15,56.2 | C12.1 75.24,58.51 v75.15,58.42 | C14.1 75.24,62.96 v75.15,62.87 | C9.2 75.28,51.3 v75.15,51.44 | C8.1 75.21,48.84 v75.15,48.9 | R12.2 75.35,38.54 v75.15,38.73 | C6.2 75.28,41.15 v75.15,41.27 | C7.1 75.21,43.76 v75.15,43.81 | R11.2 75.18,46.33 v75.15,46.35 | U5.3 v24.41,16.84 v24.41,16.85 | J1.5 9.25,67.25 J1.S4 | U1.GND v20.54,35.56
  Bottom 0.61: R17.2 C19.2 | U1.1 12.84,46.04 v12.92,46.04 12.71,46.04 C4.2 | C16.2 65.42,46.78 v65.37,46.78 | v29.13,41.27 U1.15 | 12.84,28.12 U1.38
  other vias: 51.02,63.5 45.94,63.5 56.1,63.5 62.45,63.5 39.59,63.5 16.73,64.77 62.45,64.77 62.45,66.04 61.18,64.77 86.58,68.58 86.58,63.5 86.58,58.42 86.58,17.78 86.58,12.7 86.58,7.62 86.58,2.54 81.5,2.54 76.42,2.54 71.34,2.54 66.26,2.54 61.18,2.54 7.84,5.08 7.84,10.16 7.84,15.24 7.84,20.32 7.84,50.8 7.84,55.88 81.5,68.58 76.42,68.58 71.34,68.58 66.26,68.58 58.64,68.58 53.56,68.58 43.4,68.58 40.23,68.58 28.16,68.58 12.92,41.27 12.92,36.51 16.73,40.64 28.84,35.55 24.94,35.58 38.32,65.41 33.24,65.41 16.8,48.9 18.39,50.49 24.1,48.26 12.92,42.86 12.92,39.69 12.92,38.1 12.92,34.92 12.92,33.34 12.92,31.75 12.92,30.16 12.92,28.57
  pour Bottom (no thermals): 59.06,64.25 61.4,66.59 64.58,66.59 64.58,62.67 32.33,62.67 32.33,66.68 39,66.68 41.27,64.41 arc-90 41.27,64.42 43.02,64.42 arc90 43.13,64.31 58.91,64.31 59.02,64.2
  pour Top: 5.3,0 90.39,0 90.39,72.07 5.3,72.07
  pour Bottom (rank 2): 5.3,0 90.39,0 90.39,72.39 5.3,72.39
INT0  (via drill 0.3)
  Top 0.254: U3.3 17.57,11.86 v18,11.43 | v25.65,12.28 25.65,15.72 26.76,15.72 26.76,18.72 v26.74,18.72
  Bottom 0.254: v18,11.43 R28.1 19.06,12.28 v25.65,12.28 | v26.74,18.72 U5.1
INT0A  (via drill 0.3)
  Top 0.254: v21.81,24.77 v21.81,29.53
  Bottom 0.254: U5.4 22.75,16.84 21.81,17.78 v21.81,24.77 | v21.81,29.53 25.94,33.66 25.94,38.42 21.73,42.62 U1.8
INT1A  (via drill 0.3)
  Top 0.254: v28.16,15.72 28.8,15.72 30.86,17.78 47.85,17.78 52.29,13.34 v52.29,8.26
  Bottom 0.254: U5.2 27.31,17.78 R18.2 v28.16,15.72 | v52.29,8.26 JP1.3
LEDAVAIL  (via drill 0.3)
  Top 0.254: R31.2 52.29,29.21 49.75,26.67 43.4,26.67 42.13,27.94 33.24,27.94 30.7,30.48 28.16,30.48 v26.26,32.38
  Bottom 0.254: v26.26,32.38 21.81,27.94 21.81,26.64 U1.31
LEDBUSY  (via drill 0.3)
  Top 0.254: v28.8,32.07 33.24,32.07 36.42,28.89 49.75,28.89 51.34,30.48 60.33,30.48 R32.2
  Bottom 0.254: U1.28 25.54,28.18 28.8,31.43 v28.8,32.07
LEDERR  (via drill 0.3)
  Top 0.254: R34.2 74.3,34.29 39.59,34.29 33.88,40.01 v33.24,40.01
  Bottom 0.254: v33.24,40.01 U1.16
LEDOK  (via drill 0.3)
  Top 0.254: v35.47,33.66 66.05,33.66 R33.2
  Bottom 0.254: U1.24 31.66,29.84 v35.47,33.66
N$1  (via drill 0.3)
  Top 0.305: U3.10 16.32,14.99 v16.32,16.49
  Bottom 0.305: v16.32,16.49 TP1.TP
N$2  (via drill 0.3)
  Top 0.254: U3.5 18.99,13.02 v20.23,13.02
  Bottom 0.254: v20.23,13.02 21.71,13.02 arc90 C1.1 R5.1
N$3
  Bottom 0.305: R7.2 13.34,60.05 T1.B
N$4  (via drill 0.3)
  Top 0.305: v57.78,65.2 57.78,63.59 v56.2,62.01
  Bottom 0.305: R16.1 57.77,65.19 v57.78,65.2 | v56.2,62.01 R19.1
  pour Bottom (no thermals): 51.67,62.45 51.67,61.59 52.55,60.71 54.9,60.71 55.71,61.51 56.69,61.51 56.69,60.42 55.72,60.42 55.72,60.42 55.58,60.28 52.43,60.28 51.38,61.33 51.38,62.42 51.39,62.43
N$5
  Bottom 0.305: R8.2 20.76,58.35 T2.B
N$6  (via drill 0.3)
  Top 0.305: v11.34,64.45 12.61,63.5 v12.61,62.55
  Bottom 0.305: J1.2 11,64.12 v11.34,64.45 | v12.61,62.55 13.24,63.18 13.24,64.45 13.81,65.02 IC1.4
N$7  (via drill 0.3)
  Top 0.305: v11.02,66.67 13.24,66.67 13.88,66.04 v13.88,62.55
  Bottom 0.305: J1.3 10.38,64.77 11.02,65.41 v11.02,66.67 | v13.88,62.55 13.88,64.14 14.26,64.52 IC1.3
N$8
  Bottom 0.305: IC1.16 19.94,64.52 C5.2
N$9
  Bottom 0.305: C17.1 71.34,56.91 71.34,59.69 70.35,60.68 D1.2 D2.1
N$10
  Bottom 0.61: U4.1 R10.1
N$11
  Bottom 0.254: J2.19 79.9,55.86 79.6,55.56 79.6,54.92 C10.2
N$12
  Bottom 0.305: D3.2 70.33,57.53 C17.2 70.33,53.56 Q1.3 70.38,52.81 L1.2
N$13
  Bottom 0.61: R10.2 28.96,64.38 LED1.C
N$14
  Bottom 0.254: J2.24 83.05,60.76 C15.1
N$15
  Bottom 0.254: J2.22 80.98,57.36 79.92,58.42 79.92,59.34 C13.1
N$16
  Bottom 0.254: J2.20 78.7,56.36 C11.1
N$17
  Bottom 0.254: J2.18 80.98,55.36 79.6,53.98 79.6,52.32 C9.1
N$18
  Bottom 0.254: J2.4 81.6,48.36 80.87,47.62 80.87,46.67 80.23,46.04 80.23,42.8 C6.1
N$19
  Bottom 0.254: J2.5 81.15,48.86 80.23,47.94 80.23,46.99 79.6,46.35 79.6,44.76 C7.2
N$20
  Bottom 0.61: U4.3 30.92,59.06 R14.2
N$21
  Bottom 0.254: R15.2 U4.5
N$22
  Bottom 0.813: PAD1.1 36.42,67.94 BATTERY.2
N$23
  Bottom 0.305: U6.10 52.28,64.97 R17.1 R16.2
N$24
  Bottom 0.305: U6.1 53.71,62.02 C19.1
N$25  (via drill 0.3)
  Top 0.254: v31.13,44.57 31.13,44.84 32.58,46.29 v33.58,46.29 v33.58,46.3
  Bottom 0.254: U1.14 v31.13,44.56 v31.13,44.57 | v33.58,46.3 34.26,46.3 12.TP
N$26
  Bottom 0.305: U6.7 50.52,66.96 R20.1 R21.1
N$27
  pour Bottom (no thermals): 50.88,62.45 51.16,62.45 51.16,62.44 51.16,60.98 52.33,59.82 52.33,57.08 52.28,57.03 50.97,57.03 50.94,57.06 50.94,59.81 50.88,59.87 50.88,62.43
N$28
  Bottom 0.61: U7.1 46.04,53.02 R27.2 R25.1
N$29
  Bottom 0.254: U1.13 28.08,43.58 28.48,43.18 31.58,43.18 14.TP
N$30
  Bottom 0.61: U7.3 46.04,54.92 R27.1
N$31  (via drill 0.3)
  Top 0.254: v24.27,43.25 24.27,44.66 v26.91,47.31
  Bottom 0.254: U1.10 v24.27,43.25 | v26.91,47.31 25.TP
N$32  (via drill 0.3)
  Top 0.254: v25.55,43.22 25.55,44.69 v28.16,47.31
  Bottom 0.254: U1.11 v25.54,43.23 v25.55,43.22 | v28.16,47.31 28.16,48.26 26.TP
N$33  (via drill 0.3)
  Top 0.254: v26.82,43.26 v30.87,47.31
  Bottom 0.254: U1.12 v26.81,43.26 v26.82,43.26 | v30.87,47.31 27.TP
N$34
  Top 0.305: R34.1 81.08,26.77 LED5.A
N$35
  Top 0.305: R33.1 72.19,26.77 LED4.A
N$36
  Top 0.305: R32.1 63.3,26.77 LED3.A
N$37
  Top 0.305: R31.1 54.41,26.77 LED2.A
N$39
  pour Bottom: 50.88,62.43 51.01,62.29 51.01,62.24
OUT
  Bottom 0.61: U7.5 53.46,53.02 R26.1
PREVGH
  Bottom 0.254: J2.21 80.25,56.86 C12.2 77.74,59.37 75.15,59.37 74.17,58.39 D3.1
PREVGL
  Bottom 0.254: J2.23 81.75,57.86 80.87,58.74 80.87,60.69 C14.2 77.74,63.82 75.15,63.82 74.33,62.99 D2.2
PS  (via drill 0.3)
  Top 0.305: v51.02,69.85 49.12,67.94 v49.12,65.41
  Bottom 0.305: U6.8 v51.02,69.85 | v49.12,65.41 R22.1
REGEN
  Bottom 0.254: R23.1 47.21,68.37 47.21,66.38 49.13,66.38 50.02,65.49 U6.6
RESE  (via drill 0.3)
  Top 0.305: v75.12,52.73 77.63,52.73 80.54,49.82 80.54,38.92 v78.6,36.98
  Bottom 0.254: J2.3 82.06,47.86 81.5,47.31 81.5,46.35 80.87,45.72 80.87,40.81 R12.1
  Bottom 0.305: Q1.2 74.99,52.86 v75.12,52.73 | v78.6,36.98 R12.1
RTS
  Bottom 0.305: IC1.19 17.98,61.4 R8.1 19.06,61.38 19.91,62.23 21.18,62.23 22.13,61.28 22.13,57.47 21.81,57.15 14.19,57.15 13.24,58.1 T1.E
SCL  (via drill 0.3)
  Top 0.254: v35.78,19.37 v30.07,19.37 | v30.07,22.54 27.69,22.54 26.58,23.65 16.57,23.65 v15.46,24.92
  Bottom 0.254: U2.22 37.32,14.55 R2.1 34.51,18.1 v35.78,19.37 | v30.07,19.37 v30.07,22.54 | v15.46,24.92 15.38,25.32 U1.36
SCL0  (via drill 0.3)
  Top 0.254: v14.51,17.78 20.23,17.78 20.86,17.14 20.86,14.61 20.23,13.97 18.64,13.97 18.26,13.59 U3.4 | v38.32,21.59 26.89,21.59 25.62,22.86 v14.19,22.86
  Bottom 0.254: R4.1 13.77,17.04 v14.51,17.78 14.19,18.1 v14.19,22.86 | U2.5 38.62,21.3 v38.32,21.59
SCL1
  Bottom 0.254: JP1.5 47.21,19.68 44.99,21.91 41.82,21.91 39.92,20.01 U2.7
SCL2
  Bottom 0.254: JP1.7 42.13,5.71 45.94,9.53 45.94,19.05 44.36,20.64 42.45,20.64 41.22,19.41 U2.9
SCL3
  Bottom 0.254: JP1.9 37.05,5.08 38.32,6.35 40.86,6.35 44.67,10.16 44.67,18.41 43.72,19.37 43.09,19.37 42.52,18.8 U2.11
SCL4
  Bottom 0.254: U2.14 42.52,9.91 40.23,7.62 34.51,7.62 31.97,5.08 JP1.11
SCL5
  Bottom 0.254: U2.16 41.22,10.52 39.59,8.89 30.7,8.89 26.89,5.08 JP1.13
SCL6
  Bottom 0.254: U2.18 39.92,11.12 38.96,10.16 26.89,10.16 21.81,5.08 JP1.15
SCL7
  Bottom 0.254: U2.20 38.62,11.72 38.32,11.43 23.08,11.43 16.73,5.08 JP1.17
SDA  (via drill 0.3)
  Top 0.254: v32.13,14.13 25.62,7.62 v15.46,7.62
  Bottom 0.254: U2.23 36.67,13.09 35.78,13.97 34.73,13.97 R1.1 32.19,14.19 v32.13,14.13 | v15.46,7.62 6.57,7.62 6.57,20.32 9.11,22.86 11.81,22.86 13.08,24.13 17.84,24.13 19.19,25.48 U1.33
SDA0  (via drill 0.3)
  Top 0.254: U3.2 16.89,13.5 16.42,13.97 10.7,13.97 10.38,13.65 v10.38,13.34 9.11,14.61 9.11,20.32 10.38,21.59 24.35,21.59 25.62,20.32 v37.05,20.32
  Bottom 0.254: R3.1 v10.38,13.34 | U2.4 37.97,19.41 v37.05,20.32
SDA1
  Bottom 0.254: JP1.4 49.75,7.3 47.85,9.21 47.85,20 45.31,22.54 41.5,22.54 39.28,20.32 39.28,18.16 U2.6
SDA2
  Bottom 0.254: JP1.6 44.67,7.3 46.58,9.21 46.58,19.37 44.67,21.27 42.13,21.27 40.57,19.71 U2.8
SDA3
  Bottom 0.254: JP1.8 39.59,4.76 40.23,5.4 40.86,5.4 45.31,9.84 45.31,18.73 44.04,20 42.77,20 41.87,19.1 U2.10
SDA4
  Bottom 0.254: U2.13 43.17,9.61 40.55,6.99 36.42,6.99 34.51,5.08 JP1.10
SDA5
  Bottom 0.254: U2.15 41.87,10.21 39.91,8.26 32.61,8.26 29.43,5.08 JP1.12
SDA6
  Bottom 0.254: U2.17 40.57,10.82 39.28,9.53 28.8,9.53 24.35,5.08 JP1.14
SDA7
  Bottom 0.254: U2.19 39.27,11.42 38.64,10.79 24.99,10.79 19.27,5.08 JP1.16
VBAT  (via drill 0.3)
  Top 0.305: v20.96,48.35 22.58,48.35 v33.23,59
  Bottom 0.305: R35.1 v20.96,48.35 | v33.23,59 33.23,60.82 C18.1
  Bottom 0.813: D4.2 35.15,60.73 | 35.15,60.73 33.34,60.73 C18.1 33.22,60.86 R14.1 | 35.15,60.73 35.15,64.14 38.32,67.31 40.86,67.31 42.13,68.58 PAD2.1
VBUS
  Bottom 0.305: IC1.8 15.98,68.9 16.1,68.9
  Bottom 0.406: J1.1 10.55,63.5 11.65,63.5 12.29,64.14 12.29,67.94 13.24,68.9 16.1,68.9 22.45,68.9 23.72,67.63 23.72,63.5
  Bottom 0.61: LED1.A 24.28,64.38 23.72,63.82 23.72,63.5 23.72,59.03 U4.4 27.82,57.78 39.1,57.78 C22.1
  Bottom 0.813: D4.1 42.05,60.73 C22.1
  Bottom 1.016: R25.2 42.14,56.09 C22.1
  pour Bottom (no thermals): 44.63,60.41 43.41,60.41 43.03,60.03 41.28,60.03 41.26,60.05 41.26,61.61 41.25,61.62 43.54,61.62 43.65,61.51 44.62,61.51 44.63,61.49 44.63,60.45 44.62,60.44
VIN  (via drill 0.3)
  Top 0.305: v44.99,65.41 44.99,60.64 v46.58,59.05
  Bottom 0.305: R23.2 R21.2 R22.2 v44.99,65.41 | v46.58,59.05 46.58,61.28
  pour Bottom (no thermals): 50.17,62.44 50.17,61.06 48.93,59.82 48.93,57.03 45.35,57.03 45.35,61.49 45.94,62.08 49.51,62.08 49.87,62.45 50.15,62.45 50.16,62.44

### Text on the board
tPlace: Lecturer Availability Door Announcer | Final Year BEng Project - Chris Stubbs | Touch a sensor below to notify the lecturer | Available | Busy | Notified | Error | Touch | Here
bPlace: USB | Blk | Red | ePaper | Btn A | BOOT | Btn B | RST/EN | Sensor Expansion